# EAGLE design rgb led driver (EAGLE 6.2)
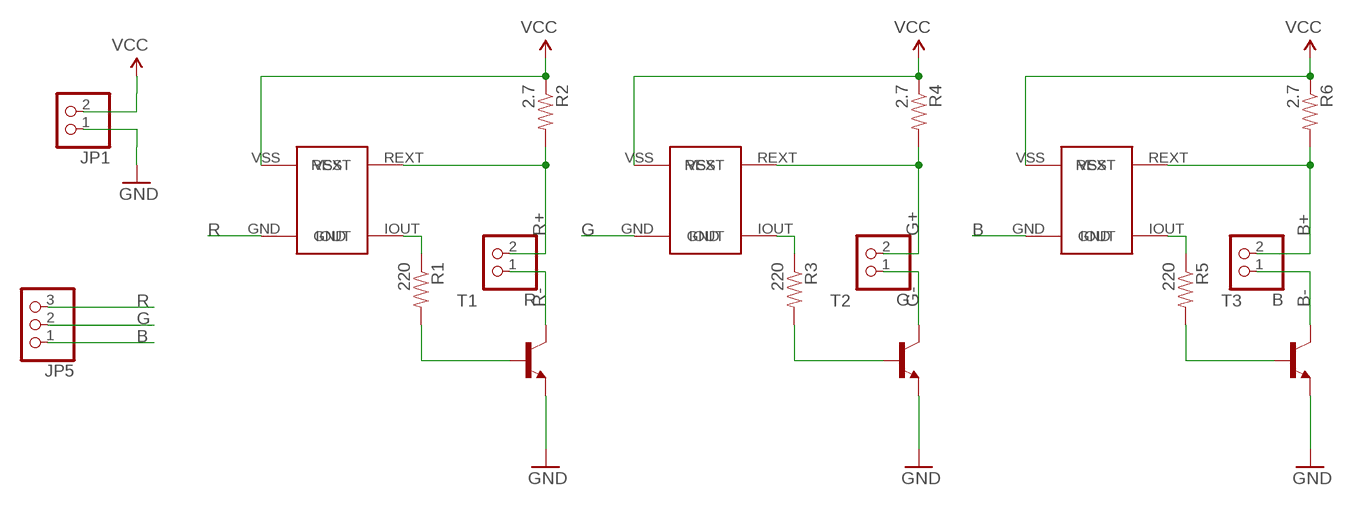
[diagram p0: schematic, sheet 1]

## Parts
B  PINHD-1X2  [1X02]
G  PINHD-1X2  [1X02]
JP1  PINHD-1X2  [1X02]
JP5  PINHD-1X3  [1X03]
R  PINHD-1X2  [1X02]
R1  220  RESISTOR  [0805]
R2  2.7  RESISTORPTH1  [AXIAL-0.3]
R3  220  RESISTOR  [0805]
R4  2.7  RESISTORPTH1  [AXIAL-0.3]
R5  220  RESISTOR  [0805]
R6  2.7  RESISTORPTH1  [AXIAL-0.3]
T1  -NPN-SOT89-BCE  [SOT89-BCE]
T2  -NPN-SOT89-BCE  [SOT89-BCE]
T3  -NPN-SOT89-BCE  [SOT89-BCE]
U$1  BCR401W  [SOT-343]
U$2  BCR401W  [SOT-343]
U$9  BCR401W  [SOT-343]

## Nets
3.3V: JP1.2 R2.P$1 R4.P$1 R6.P$1 U$1.VSS U$2.VSS U$9.VSS ; supply symbol labelled VCC
B: JP5.1 U$2.GND
B+: B.2 R6.P$2 U$2.REXT
B-: B.1 T3.C
G: JP5.2 U$1.GND
G+: G.2 R4.P$2 U$1.REXT
G-: G.1 T2.C
GND: JP1.1 T1.E T2.E T3.E
N$1: R1.2 T1.B
N$3: R3.1 U$1.IOUT
N$5: R3.2 T2.B
N$7: R5.1 U$2.IOUT
N$9: R5.2 T3.B
N$42: R1.1 U$9.IOUT
R: JP5.3 U$9.GND
R+: R2.P$2 R.2 U$9.REXT
R-: R.1 T1.C

## Library data of the parts
B G JP1 R = pinhead:PINHD-1X2: PIN HEADER
JP5 = pinhead:PINHD-1X3: PIN HEADER
R1-R6 = SparkFun:RESISTOR: Resistor Basic schematic elements and footprints for 0603, 1206, and PTH 1/10th watt (small) resistors.
T1-T3 = transistor-neu-to92:*-NPN-: NPN Transistror
U$1 U$2 U$9 = bcr401w:BCR401W: LED DRIVER, LOW POWER LEDS, 4SOT343 LED Driver Application: Aircraft, LED Strips for Decorative Lighting, Ship Illumination, Train Topology: Constant Current No. of Outputs: 1 Output Current: 10mA Output Voltage: 16V Dimming Control Type: Digital Driver Case Style: SOT-343 SVHC: No SVHC (19-Dec-2011) Device Type: LED No. of Pins: 4 Supply Voltage Max: 18V Termination Type: SMD http://ro.farnell.com/infineon/bcr401w/led-driver-low-power-leds-4sot343/dp/1791058

## Board
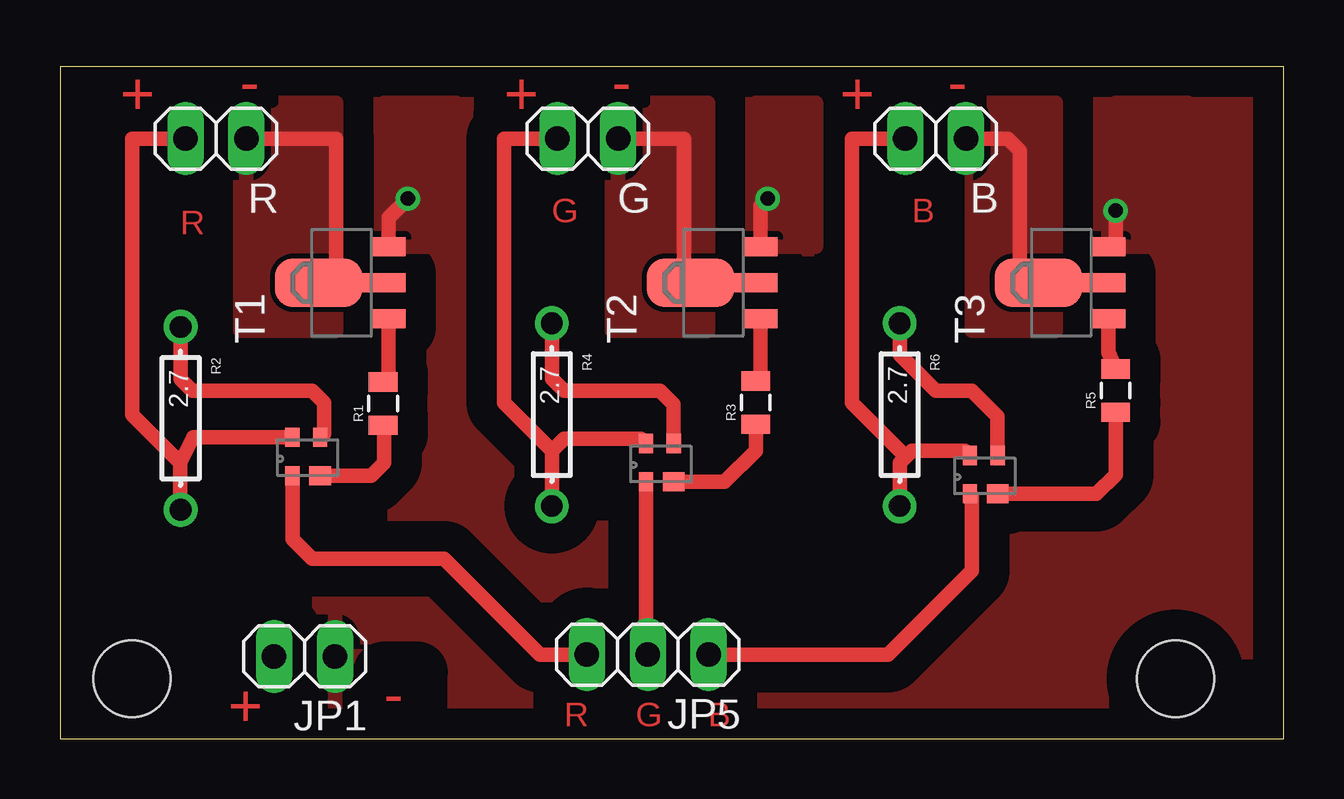
[diagram p1: board, top side]
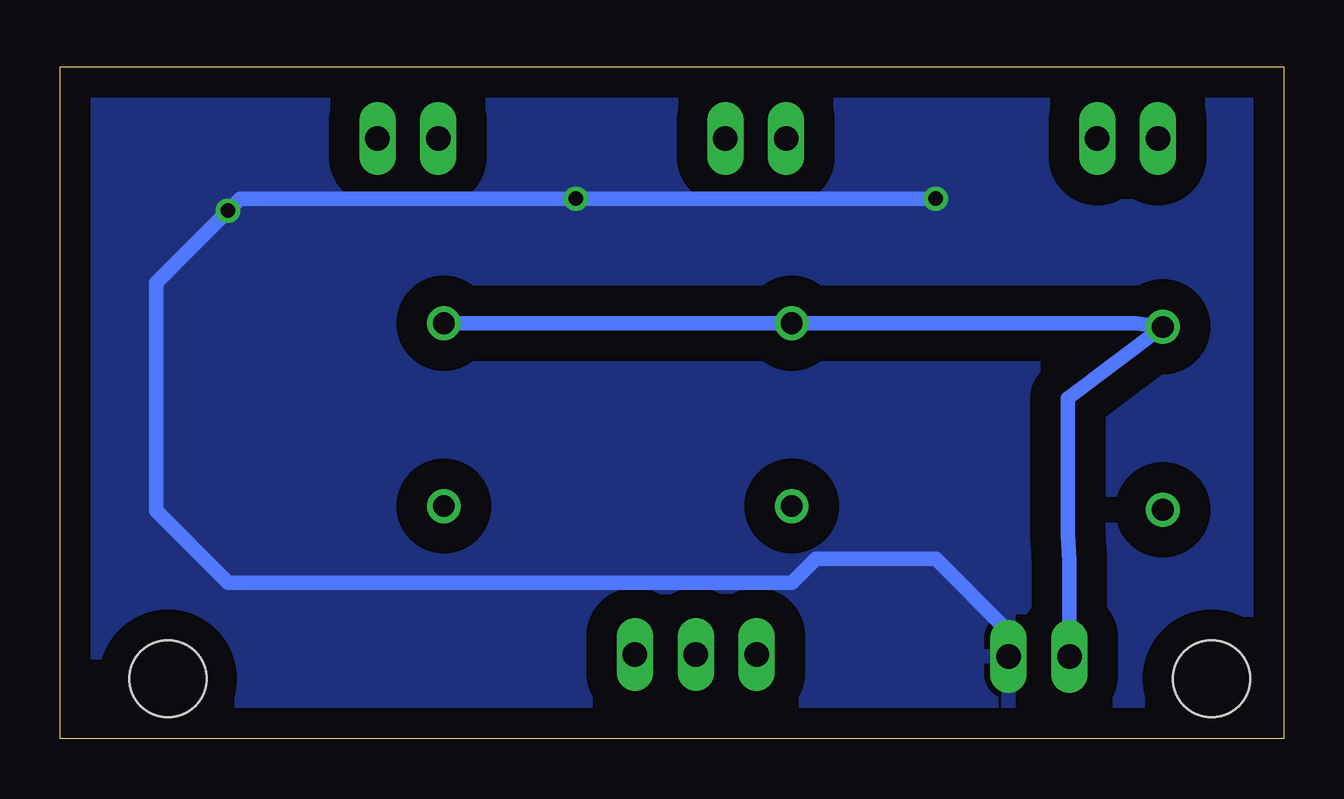
[diagram p2: board, bottom side, seen from below]

Size 51 x 28 mm. Coordinates in mm from the lower left corner, seen from the top.
Outline: 0,0 51,0 51,28 0,28 0,0
Copper layers (1*16): Top 0.035mm / dielectric 1.5mm / Bottom 0.035mm
Design rules: minimum track width 10mil, minimum drill 24mil, track to track 8mil, track to pad 8mil, pad to pad 8mil, via to via 8mil, smd to smd 8mil, copper to edge 40mil, drill to drill 8mil, minimum pad ring 10mil, minimum via ring 8mil, stop-mask expansion 4mil, vias tented up to drill 0mil, thermal gap 10mil
Holes 3.2 mm at 3,2.5 46.5,2.5

### Footprints (pad centres in the part's own frame; a part is rotated, then mirrored left to right if it is on the bottom)
1X02 = drill 1.016 long: 1 -1.27,0; 2 1.27,0
1X03 = drill 1.016 long: 1 -2.54,0; 2 0,0; 3 2.54,0
0805 = smd 0.8 x 1.2: 1 -0.9,0; 2 0.9,0
AXIAL-0.3 = drill 0.9: P$1 -3.81,0; P$2 3.81,0
SOT89-BCE = smd 0.8 x 1.4: B -1.499,-1.981; E 1.499,-1.981 | smd 0.8 x 1.9: C 0,-1.727 | smd 2.032 x 3.65: C@1 0,0.94
SOT-343 = smd 0.6 x 0.8: GND -0.575,-0.8; REXT -0.575,0.8; VSS 0.575,0.8 | smd 0.9 x 0.8: IOUT 0.575,-0.8

### Placement (x,y rotation side)
B  36.5,25 180 top
G  22,25 180 top
JP1  10.19,3.43 180 top
JP5  24.5,3.5 180 top
R  6.5,25 180 top
R1  13.47,13.96 90 top
R2  5.03,13.35 270 top
R3  29,14 90 top
R4  20.5,13.5 270 top
R5  44,14.5 90 top
R6  35,13.5 270 top
T1  11.72,19 90 top
T2  27.22,19 90 top
T3  41.72,19 90 top
U$1  25,11.5 0 top
U$2  38.5,11 0 top
U$9  10.27,11.76 0 top

### Tracks (layer width: path | path; a pad name or v marks a point on that pad's centre or on a via)
3.3V
  Top 0.61: U$2.VSS 39.08,13.43 38,14.5 36.5,14.5 35,16 R6.P$1 | U$1.VSS 25.57,13.93 25,14.5 21,14.5 20.5,15 R4.P$1 | R2.P$1 5.03,14.97 5.5,14.5 10.5,14.5 11,14 11,12.71 U$9.VSS
  Bottom 0.61: R6.P$1 R4.P$1 6.18,17.31 R2.P$1 9,14.19 9,8.5 8.92,7.42 JP1.2
B
  Top 0.61: JP5.1 34.5,3.5 38,7 38,10.12 U$2.GND
B+
  Top 0.61: R6.P$2 35,11.5 35.25,11.75 | 35.25,11.75 35.5,12 37.73,12 U$2.REXT | B.2 33,25 33,14 35.25,11.75
B-
  Top 0.61: B.1 39.5,25 40,24.5 40,19 T3.C
  pour Top: 38,26.5 41.5,26.5 41.5,17 38,17
G
  Top 0.61: U$1.GND 24.43,3.58 JP5.2
G+
  Top 0.61: R4.P$2 20.5,12 | 20.5,12 21,12.5 24.23,12.5 U$1.REXT | G.2 18.5,25 18.5,14 20.5,12
G-
  Top 0.61: G.1 26,25 26,19 T2.C
  pour Top: 23,26.5 27,26.5 27,17 23,17
GND  (via drill 0.6)
  Top 0.61: T1.E 13.7,21.7 v14.5,22.5 | v44,22 44,20.8 T3.E | T2.E 29.2,22.2 v29.5,22.5
  Bottom 0.61: v14.5,22.5 43.5,22.5 v44,22 47,19 47,9.5 44,6.5 20.5,6.5 19.5,7.5 14.5,7.5 11.46,4.46 JP1.1
  pour Top (isolate 1.27, rank 3): 0,28 51,28 51,0 0,0
  pour Bottom (isolate 1.27, rank 3): 0,28 51,28 51,0 0,0
  pour Top: 14,20.5 16.5,20.5 16.5,26.5 13.5,26.5 13.5,20.5
  pour Top: 29,21 29,26.5 31.5,26.5 31.5,20.5 29,20.5
  pour Top: 44,21 44,26.5 47,26.5 47,20.5 44,20.5
N$1
  Top 0.61: T1.B 13.7,15.09 R1.2
N$2  (via drill 0.6)
  other vias: 3,2.5
N$3
  Top 0.61: U$1.IOUT 27.7,10.7 29,12 R3.1
N$4  (via drill 0.6)
  other vias: 46.5,2.5
N$5
  Top 0.61: T2.B 29.2,15.1 R3.2
N$7
  Top 0.61: U$2.IOUT 43.2,10.2 44,11 R5.1
N$9
  Top 0.61: T3.B 43.7,16.1 R5.2
N$42
  Top 0.61: U$9.IOUT 12.96,10.96 13.5,11.5 13.5,13.03 R1.1
R
  Top 0.61: U$9.GND 9.7,8.3 10.5,7.5 16,7.5 20,3.5 JP5.3
R+
  Top 0.61: U$9.REXT 5.56,12.56 5,11.5 | 5,11.5 5,9.57 R2.P$2 | R.2 3,25 3,13.5 5,11.5
R-
  Top 0.61: R.1 11.5,25 11.5,19 T1.C
  pour Top: 8,26.5 11.5,26.5 11.5,17 7.5,17 7.5,26.5

### Text on the board
Top: + | - | + | - | + | - | G | B | R | - | + | R | G | B